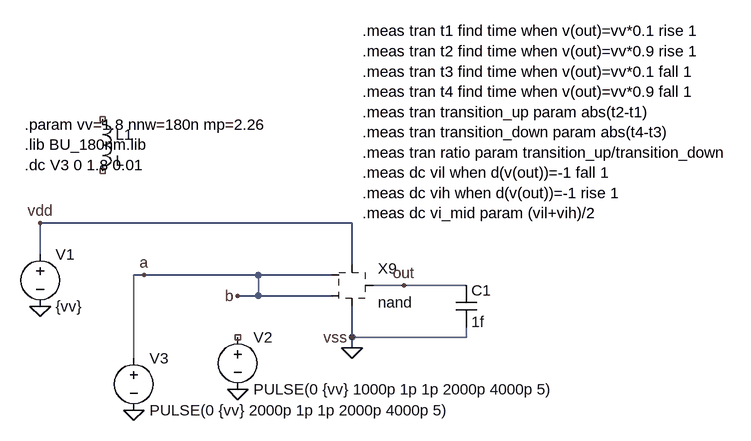
[diagram p0: schematic nand_test.asc]
nand_test.asc, the LTspice schematic file:
Version 4
SHEET 1 1168 680
WIRE 416 224 -64 224
WIRE -64 272 -64 224
WIRE 416 288 416 224
WIRE 96 304 80 304
WIRE 272 304 96 304
WIRE 384 304 272 304
WIRE 496 320 448 320
WIRE 592 320 496 320
WIRE 272 336 272 304
WIRE 272 336 240 336
WIRE 384 336 272 336
WIRE 416 400 416 352
WIRE 592 400 592 384
WIRE 592 400 416 400
WIRE 416 416 416 400
WIRE 80 432 80 304
FLAG -64 352 0
FLAG 240 480 0
FLAG 416 416 0
FLAG -64 224 vdd
FLAG 416 400 vss
FLAG 240 336 b
FLAG 496 320 out
FLAG 80 512 0
FLAG 96 304 a
SYMBOL /voltage -64 256 R0
SYMATTR InstName V1
SYMATTR Value {vv}
SYMBOL /voltage 240 384 R0
SYMATTR InstName V2
SYMATTR Value PULSE(0 {vv} 1000p 1p 1p 2000p 4000p 5)
SYMBOL nand 416 320 R0
SYMATTR InstName X9
SYMATTR SpiceLine ll=180n wn={nnw} wp={nnw*mp}
SYMBOL /voltage 80 416 R0
SYMATTR InstName V3
SYMATTR Value PULSE(0 {vv} 2000p 1p 1p 2000p 4000p 5)
SYMBOL cap 576 320 R0
SYMATTR InstName C1
SYMATTR Value 1f
SYMBOL ind 16 48 R0
SYMATTR InstName L1
TEXT -88 72 Left 2 !.param vv=1.8 nnw=180n mp=2.26\n.lib BU_180nm.lib\n.dc V3 0 1.8 0.01
TEXT 432 -72 Left 2 !.meas tran t1 find time when v(out)=vv*0.1 rise 1\n.meas tran t2 find time when v(out)=vv*0.9 rise 1\n.meas tran t3 find time when v(out)=vv*0.1 fall 1\n.meas tran t4 find time when v(out)=vv*0.9 fall 1\n.meas tran transition_up param abs(t2-t1)\n.meas tran transition_down param abs(t4-t3)\n.meas tran ratio param transition_up/transition_down\n.meas dc vil when d(v(out))=-1 fall 1\n.meas dc vih when d(v(out))=-1 rise 1\n.meas dc vi_mid param (vil+vih)/2

The netlist it stands for:
* nand_test.asc
V1 vdd 0 {vv}
V2 NC_01 0 PULSE(0 {vv} 1000p 1p 1p 2000p 4000p 5)
* X9: nand ll=180n wn={nnw} wp={nnw*mp} (symbol nand not available, pin order unknown); nets seen at it: 0, a, out, vdd
V3 a 0 PULSE(0 {vv} 2000p 1p 1p 2000p 4000p 5)
C1 out 0 1f
L1 NC_02 NC_03 L
.param vv=1.8 nnw=180n mp=2.26
.lib BU_180nm.lib
.dc V3 0 1.8 0.01
.meas tran t1 find time when v(out)=vv*0.1 rise 1
.meas tran t2 find time when v(out)=vv*0.9 rise 1
.meas tran t3 find time when v(out)=vv*0.1 fall 1
.meas tran t4 find time when v(out)=vv*0.9 fall 1
.meas tran transition_up param abs(t2-t1)
.meas tran transition_down param abs(t4-t3)
.meas tran ratio param transition_up/transition_down
.meas dc vil when d(v(out))=-1 fall 1
.meas dc vih when d(v(out))=-1 rise 1
.meas dc vi_mid param (vil+vih)/2
.backanno
.end